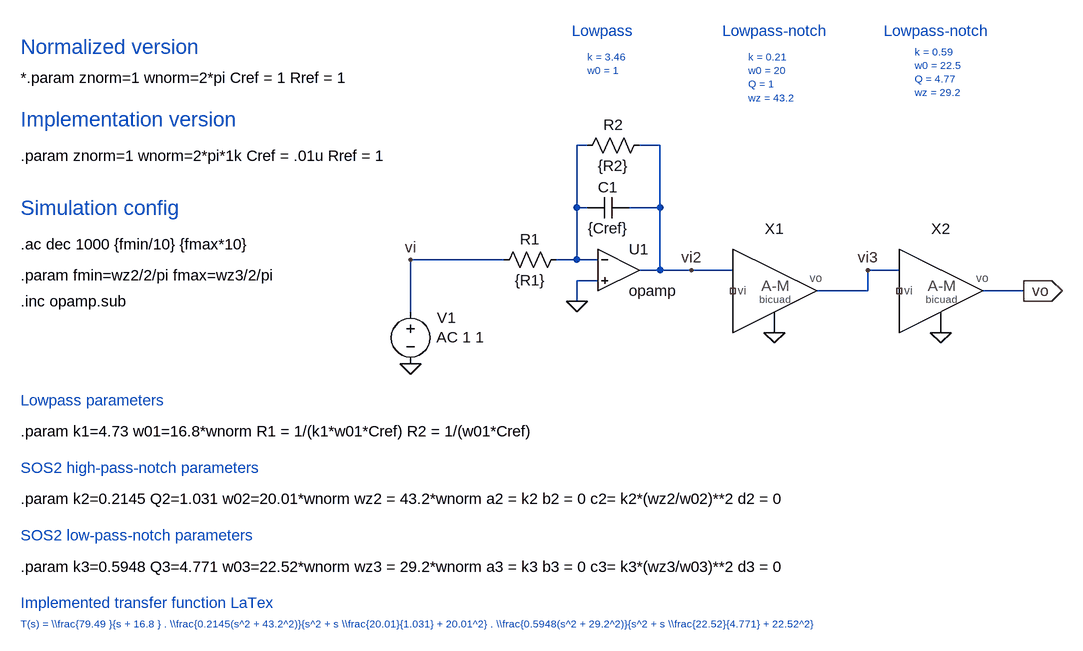
[diagram p0: schematic Ej_5.17_con_ackmoss.asc]
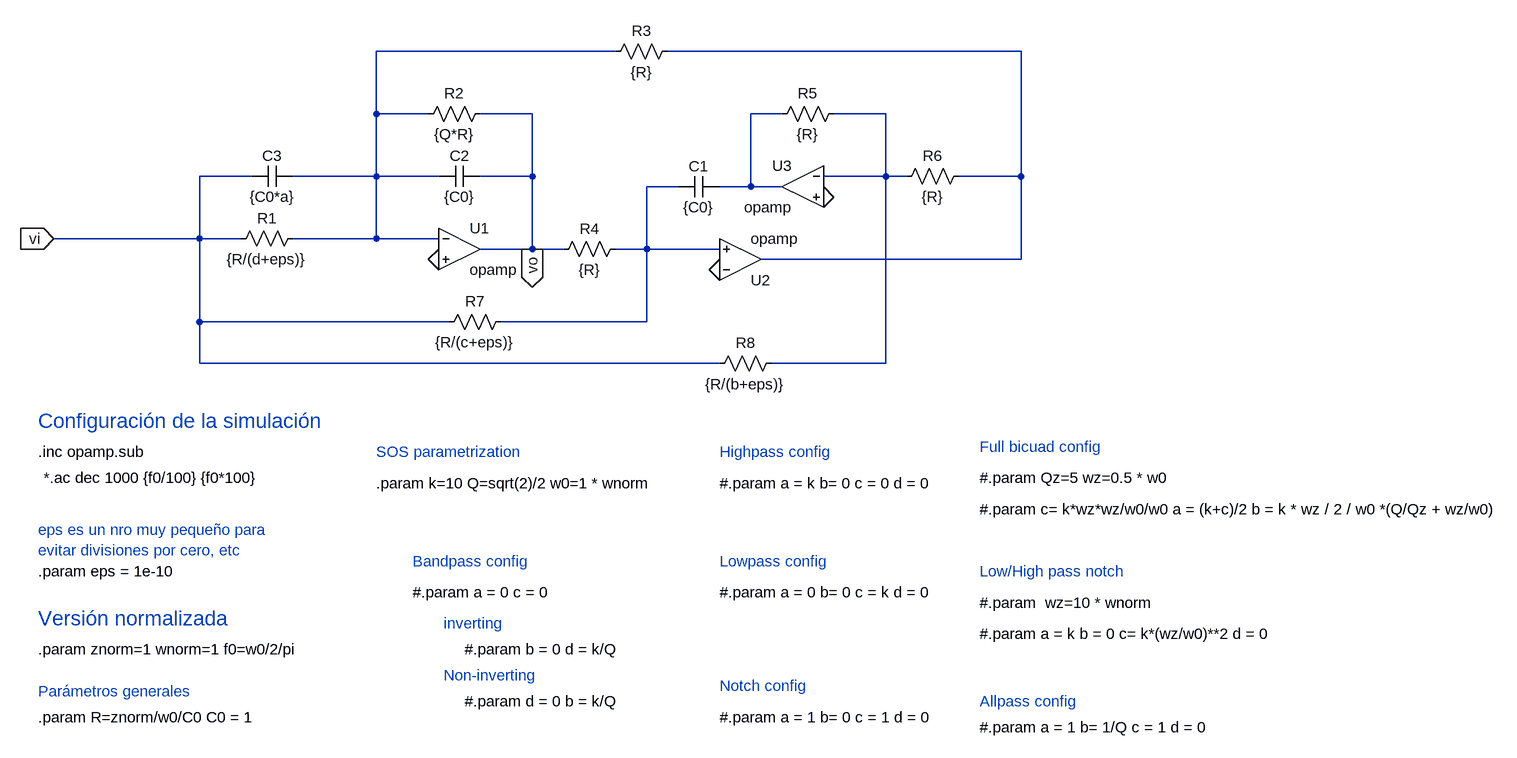
[diagram p1: sub-circuit ack_moss_bicuad.asc]
Ej_5.17_con_ackmoss.asc, the LTspice schematic file:
Version 4
SHEET 1 2616 1448
WIRE -128 176 -144 176
WIRE -16 176 -48 176
WIRE -144 272 -144 176
WIRE -128 272 -144 272
WIRE -16 272 -16 176
WIRE -16 272 -64 272
WIRE -256 352 -400 352
WIRE -144 352 -144 272
WIRE -144 352 -176 352
WIRE -112 352 -144 352
WIRE -16 368 -16 272
WIRE -16 368 -48 368
WIRE 32 368 -16 368
WIRE 96 368 32 368
WIRE 352 368 304 368
WIRE -112 384 -144 384
WIRE 304 400 304 368
WIRE 304 400 224 400
WIRE 544 400 480 400
WIRE -144 416 -144 384
WIRE -400 432 -400 352
FLAG -400 512 0
FLAG -400 352 vi
FLAG 544 400 vo
IOPIN 544 400 Out
FLAG 32 368 vi2
FLAG 304 368 vi3
FLAG -144 416 0
SYMBOL voltage -400 416 R0
WINDOW 123 40 55 Left 2
WINDOW 39 0 0 Left 0
WINDOW 0 41 25 Left 2
SYMATTR Value2 AC 1 1
SYMATTR InstName V1
SYMATTR Value ""
SYMBOL ack_moss_bicuad 160 368 R0
SYMATTR InstName X1
SYMATTR SpiceLine C0 = Cref k=k2 Q=Q2 w0=w02 wz=wz2 c= c2 a = a2 b = b2 d=d2
SYMBOL ack_moss_bicuad 416 368 R0
SYMATTR InstName X2
SYMATTR SpiceLine C0 = Cref k=k3 Q=Q3 w0=w03 wz=wz3 c= c3 a = a3 b = b3 d=d3
SYMBOL OpAmps\\opamp -80 304 R0
SYMATTR InstName U1
SYMBOL res -160 336 R90
WINDOW 0 0 56 VBottom 2
WINDOW 3 32 56 VTop 2
SYMATTR InstName R1
SYMATTR Value {R1}
SYMBOL res -32 160 R90
WINDOW 0 0 56 VBottom 2
WINDOW 3 32 56 VTop 2
SYMATTR InstName R2
SYMATTR Value {R2}
SYMBOL cap -64 256 R90
WINDOW 0 0 32 VBottom 2
WINDOW 3 32 32 VTop 2
SYMATTR InstName C1
SYMATTR Value {Cref}
TEXT -1000 192 Left 2 !.param znorm=1 wnorm=2*pi*1k Cref = .01u Rref = 1
TEXT -1000 136 Left 3 ;Implementation version
TEXT -1000 328 Left 2 !.ac dec 1000 {fmin/10} {fmax*10}
TEXT -1000 24 Left 3 ;Normalized version
TEXT -1000 72 Left 2 !*.param znorm=1 wnorm=2*pi Cref = 1 Rref = 1
TEXT -1000 272 Left 3 ;Simulation config
TEXT -1000 616 Left 2 !.param k1=4.73 w01=16.8*wnorm R1 = 1/(k1*w01*Cref) R2 = 1/(w01*Cref)
TEXT -1000 568 Left 2 ;Lowpass parameters
TEXT -1000 776 Left 2 ;SOS2 low-pass-notch parameters
TEXT -1000 824 Left 2 !.param k3=0.5948 Q3=4.771 w03=22.52*wnorm wz3 = 29.2*wnorm a3 = k3 b3 = 0 c3= k3*(wz3/w03)**2 d3 = 0
TEXT -1000 720 Left 2 !.param k2=0.2145 Q2=1.031 w02=20.01*wnorm wz2 = 43.2*wnorm a2 = k2 b2 = 0 c2= k2*(wz2/w02)**2 d2 = 0
TEXT -1000 672 Left 2 ;SOS2 high-pass-notch parameters
TEXT -1000 376 Left 2 !.param fmin=wz2/2/pi fmax=wz3/2/pi
TEXT -152 0 Left 2 ;Lowpass
TEXT 328 0 Left 2 ;Lowpass-notch
TEXT -128 40 Left 1 ;k = 3.46\nw0 = 1
TEXT 120 40 Left 1 ;k = 0.21\nw0 = 20\nQ = 1\nwz = 43.2
TEXT 376 32 Left 1 ;k = 0.59\nw0 = 22.5\nQ = 4.77\nwz = 29.2
TEXT 80 0 Left 2 ;Lowpass-notch
TEXT -1000 416 Left 2 !.inc opamp.sub
TEXT -1000 912 Left 1 ;T(s) = \\\\frac{79.49 }{s + 16.8 } . \\\\frac{0.2145(s^2 + 43.2^2)}{s^2 + s \\\\frac{20.01}{1.031} + 20.01^2} . \\\\frac{0.5948(s^2 + 29.2^2)}{s^2 + s \\\\frac{22.52}{4.771} + 22.52^2}
TEXT -1000 880 Left 2 ;Implemented transfer function LaTex

ack_moss_bicuad.asc, the sub-circuit schematic file:
Version 4
SHEET 1 2172 1280
WIRE 384 -48 16 -48
WIRE 1008 -48 464 -48
WIRE 16 48 16 -48
WIRE 96 48 16 48
WIRE 256 48 176 48
WIRE 640 48 592 48
WIRE 800 48 720 48
WIRE -176 144 -256 144
WIRE 16 144 16 48
WIRE 16 144 -112 144
WIRE 112 144 16 144
WIRE 256 144 256 48
WIRE 256 144 176 144
WIRE 800 144 800 48
WIRE 800 144 704 144
WIRE 832 144 800 144
WIRE 1008 144 1008 -48
WIRE 1008 144 912 144
WIRE 480 160 432 160
WIRE 592 160 592 48
WIRE 592 160 544 160
WIRE 640 160 592 160
WIRE -256 240 -256 144
WIRE -256 240 -480 240
WIRE -192 240 -256 240
WIRE 16 240 16 144
WIRE 16 240 -112 240
WIRE 112 240 16 240
WIRE 256 256 256 144
WIRE 256 256 176 256
WIRE 304 256 256 256
WIRE 432 256 432 160
WIRE 432 256 384 256
WIRE 544 256 432 256
WIRE 1008 272 1008 144
WIRE 1008 272 608 272
WIRE -256 368 -256 240
WIRE 128 368 -256 368
WIRE 432 368 432 256
WIRE 432 368 208 368
WIRE -256 432 -256 368
WIRE 544 432 -256 432
WIRE 800 432 800 144
WIRE 800 432 624 432
FLAG 544 288 0
FLAG 112 272 0
FLAG 704 176 0
FLAG 256 256 vo
IOPIN 256 256 Out
FLAG -480 240 vi
IOPIN -480 240 In
SYMBOL res -96 224 R90
WINDOW 0 0 56 VBottom 2
WINDOW 3 32 56 VTop 2
SYMATTR InstName R1
SYMATTR Value {R/(d+eps)}
SYMBOL res 192 32 R90
WINDOW 0 0 56 VBottom 2
WINDOW 3 32 56 VTop 2
SYMATTR InstName R2
SYMATTR Value {Q*R}
SYMBOL res 480 -64 R90
WINDOW 0 0 56 VBottom 2
WINDOW 3 32 56 VTop 2
SYMATTR InstName R3
SYMATTR Value {R}
SYMBOL res 400 240 R90
WINDOW 0 0 56 VBottom 2
WINDOW 3 32 56 VTop 2
SYMATTR InstName R4
SYMATTR Value {R}
SYMBOL res 736 32 R90
WINDOW 0 0 56 VBottom 2
WINDOW 3 32 56 VTop 2
SYMATTR InstName R5
SYMATTR Value {R}
SYMBOL res 928 128 R90
WINDOW 0 0 56 VBottom 2
WINDOW 3 32 56 VTop 2
SYMATTR InstName R6
SYMATTR Value {R}
SYMBOL cap 544 144 R90
WINDOW 0 0 32 VBottom 2
WINDOW 3 32 32 VTop 2
SYMATTR InstName C1
SYMATTR Value {C0}
SYMBOL cap 176 128 R90
WINDOW 0 0 32 VBottom 2
WINDOW 3 32 32 VTop 2
SYMATTR InstName C2
SYMATTR Value {C0}
SYMBOL OpAmps\\opamp 144 192 R0
SYMATTR InstName U1
SYMBOL OpAmps\\opamp 576 336 M180
SYMATTR InstName U2
SYMBOL OpAmps\\opamp 672 96 M0
SYMATTR InstName U3
SYMBOL cap -112 128 R90
WINDOW 0 0 32 VBottom 2
WINDOW 3 32 32 VTop 2
SYMATTR InstName C3
SYMATTR Value {C0*a}
SYMBOL res 224 352 R90
WINDOW 0 0 56 VBottom 2
WINDOW 3 32 56 VTop 2
SYMATTR InstName R7
SYMATTR Value {R/(c+eps)}
SYMBOL res 640 416 R90
WINDOW 0 0 56 VBottom 2
WINDOW 3 32 56 VTop 2
SYMATTR InstName R8
SYMATTR Value {R/(b+eps)}
TEXT -504 568 Left 2 !.inc opamp.sub
TEXT -496 608 Left 2 !*.ac dec 1000 {f0/100} {f0*100}
TEXT 944 608 Left 2 !#.param Qz=5 wz=0.5 * w0
TEXT -504 824 Left 3 ;Versión normalizada
TEXT -504 872 Left 2 !.param znorm=1 wnorm=1 f0=w0/2/pi
TEXT 944 560 Left 2 ;Full bicuad config
TEXT -504 976 Left 2 !.param R=znorm/w0/C0 C0 = 1
TEXT -504 520 Left 3 ;Configuración de la simulación
TEXT 944 656 Left 2 !#.param c= k*wz*wz/w0/w0 a = (k+c)/2 b = k * wz / 2 / w0 *(Q/Qz + wz/w0)
TEXT 944 752 Left 2 ;Low/High pass notch
TEXT 944 848 Left 2 !#.param a = k b = 0 c= k*(wz/w0)**2 d = 0
TEXT 944 800 Left 2 !#.param  wz=10 * wnorm
TEXT 544 568 Left 2 ;Highpass config
TEXT 544 616 Left 2 !#.param a = k b= 0 c = 0 d = 0
TEXT 16 616 Left 2 !.param k=10 Q=sqrt(2)/2 w0=1 * wnorm
TEXT 944 952 Left 2 ;Allpass config
TEXT 944 992 Left 2 !#.param a = 1 b= 1/Q c = 1 d = 0
TEXT 544 736 Left 2 ;Lowpass config
TEXT 544 784 Left 2 !#.param a = 0 b= 0 c = k d = 0
TEXT 72 736 Left 2 ;Bandpass config
TEXT 72 784 Left 2 !#.param a = 0 c = 0
TEXT -504 936 Left 2 ;Parámetros generales
TEXT -504 752 Left 2 !.param eps = 1e-10
TEXT -504 688 Left 2 ;eps es un nro muy pequeño para\nevitar divisiones por cero, etc
TEXT 16 568 Left 2 ;SOS parametrization
TEXT 544 928 Left 2 ;Notch config
TEXT 544 976 Left 2 !#.param a = 1 b= 0 c = 1 d = 0
TEXT 120 832 Left 2 ;inverting
TEXT 120 912 Left 2 ;Non-inverting
TEXT 152 872 Left 2 !#.param b = 0 d = k/Q
TEXT 152 952 Left 2 !#.param d = 0 b = k/Q

The netlist it stands for:
* Ej_5.17_con_ackmoss.asc
V1 vi 0 AC 1 1
XX1 NC_01 vi3 ack_moss_bicuad params: C0 = Cref k=k2 Q=Q2 w0=w02 wz=wz2 c= c2 a = a2 b = b2 d=d2
XX2 NC_02 vo ack_moss_bicuad params: C0 = Cref k=k3 Q=Q3 w0=w03 wz=wz3 c= c3 a = a3 b = b3 d=d3
XU1 N001 0 vi2 opamp Aol=100K GBW=10Meg  ; pins invin noninvin out
R1 N001 vi {R1}
R2 vi2 N001 {R2}
C1 vi2 N001 {Cref}

* block symbol definitions
.subckt ack_moss_bicuad vi vo
R1 N001 vi {R/(d+eps)}
R2 vo N001 {Q*R}
R3 N002 N001 {R}
R4 N005 vo {R}
R5 N004 N003 {R}
R6 N002 N004 {R}
C1 N003 N005 {C0}
C2 vo N001 {C0}
XU1 N001 0 vo opamp Aol=100K GBW=10Meg  ; pins invin noninvin out
XU2 0 N005 N002 opamp Aol=100K GBW=10Meg  ; pins invin noninvin out
XU3 N004 0 N003 opamp Aol=100K GBW=10Meg  ; pins invin noninvin out
C3 N001 vi {C0*a}
R7 N005 vi {R/(c+eps)}
R8 N004 vi {R/(b+eps)}
.inc opamp.sub
*.ac dec 1000 {f0/100} {f0*100}
#.param Qz=5 wz=0.5 * w0
* Versión normalizada
.param znorm=1 wnorm=1 f0=w0/2/pi
* Full bicuad config
.param R=znorm/w0/C0 C0 = 1
* Configuración de la simulación
#.param c= k*wz*wz/w0/w0 a = (k+c)/2 b = k * wz / 2 / w0 *(Q/Qz + wz/w0)
* Low/High pass notch
#.param a = k b = 0 c= k*(wz/w0)**2 d = 0
#.param  wz=10 * wnorm
* Highpass config
#.param a = k b= 0 c = 0 d = 0
.param k=10 Q=sqrt(2)/2 w0=1 * wnorm
* Allpass config
#.param a = 1 b= 1/Q c = 1 d = 0
* Lowpass config
#.param a = 0 b= 0 c = k d = 0
* Bandpass config
#.param a = 0 c = 0
* Parámetros generales
.param eps = 1e-10
* eps es un nro muy pequeño para
* evitar divisiones por cero, etc
* SOS parametrization
* Notch config
#.param a = 1 b= 0 c = 1 d = 0
* inverting
* Non-inverting
#.param b = 0 d = k/Q
#.param d = 0 b = k/Q
.ends ack_moss_bicuad

.param znorm=1 wnorm=2*pi*1k Cref = .01u Rref = 1
* Implementation version
.ac dec 1000 {fmin/10} {fmax*10}
* Normalized version
*.param znorm=1 wnorm=2*pi Cref = 1 Rref = 1
* Simulation config
.param k1=4.73 w01=16.8*wnorm R1 = 1/(k1*w01*Cref) R2 = 1/(w01*Cref)
* Lowpass parameters
* SOS2 low-pass-notch parameters
.param k3=0.5948 Q3=4.771 w03=22.52*wnorm wz3 = 29.2*wnorm a3 = k3 b3 = 0 c3= k3*(wz3/w03)**2 d3 = 0
.param k2=0.2145 Q2=1.031 w02=20.01*wnorm wz2 = 43.2*wnorm a2 = k2 b2 = 0 c2= k2*(wz2/w02)**2 d2 = 0
* SOS2 high-pass-notch parameters
.param fmin=wz2/2/pi fmax=wz3/2/pi
* Lowpass
* Lowpass-notch
* k = 3.46
* w0 = 1
* k = 0.21
* w0 = 20
* Q = 1
* wz = 43.2
* k = 0.59
* w0 = 22.5
* Q = 4.77
* wz = 29.2
* Lowpass-notch
.inc opamp.sub
* T(s) = \\frac{79.49 }{s + 16.8 } . \\frac{0.2145(s^2 + 43.2^2)}{s^2 + s \\frac{20.01}{1.031} + 20.01^2} . \\frac{0.5948(s^2 + 29.2^2)}{s^2 + s \\frac{22.52}{4.771} + 22.52^2}
* Implemented transfer function LaTex
.backanno
.end